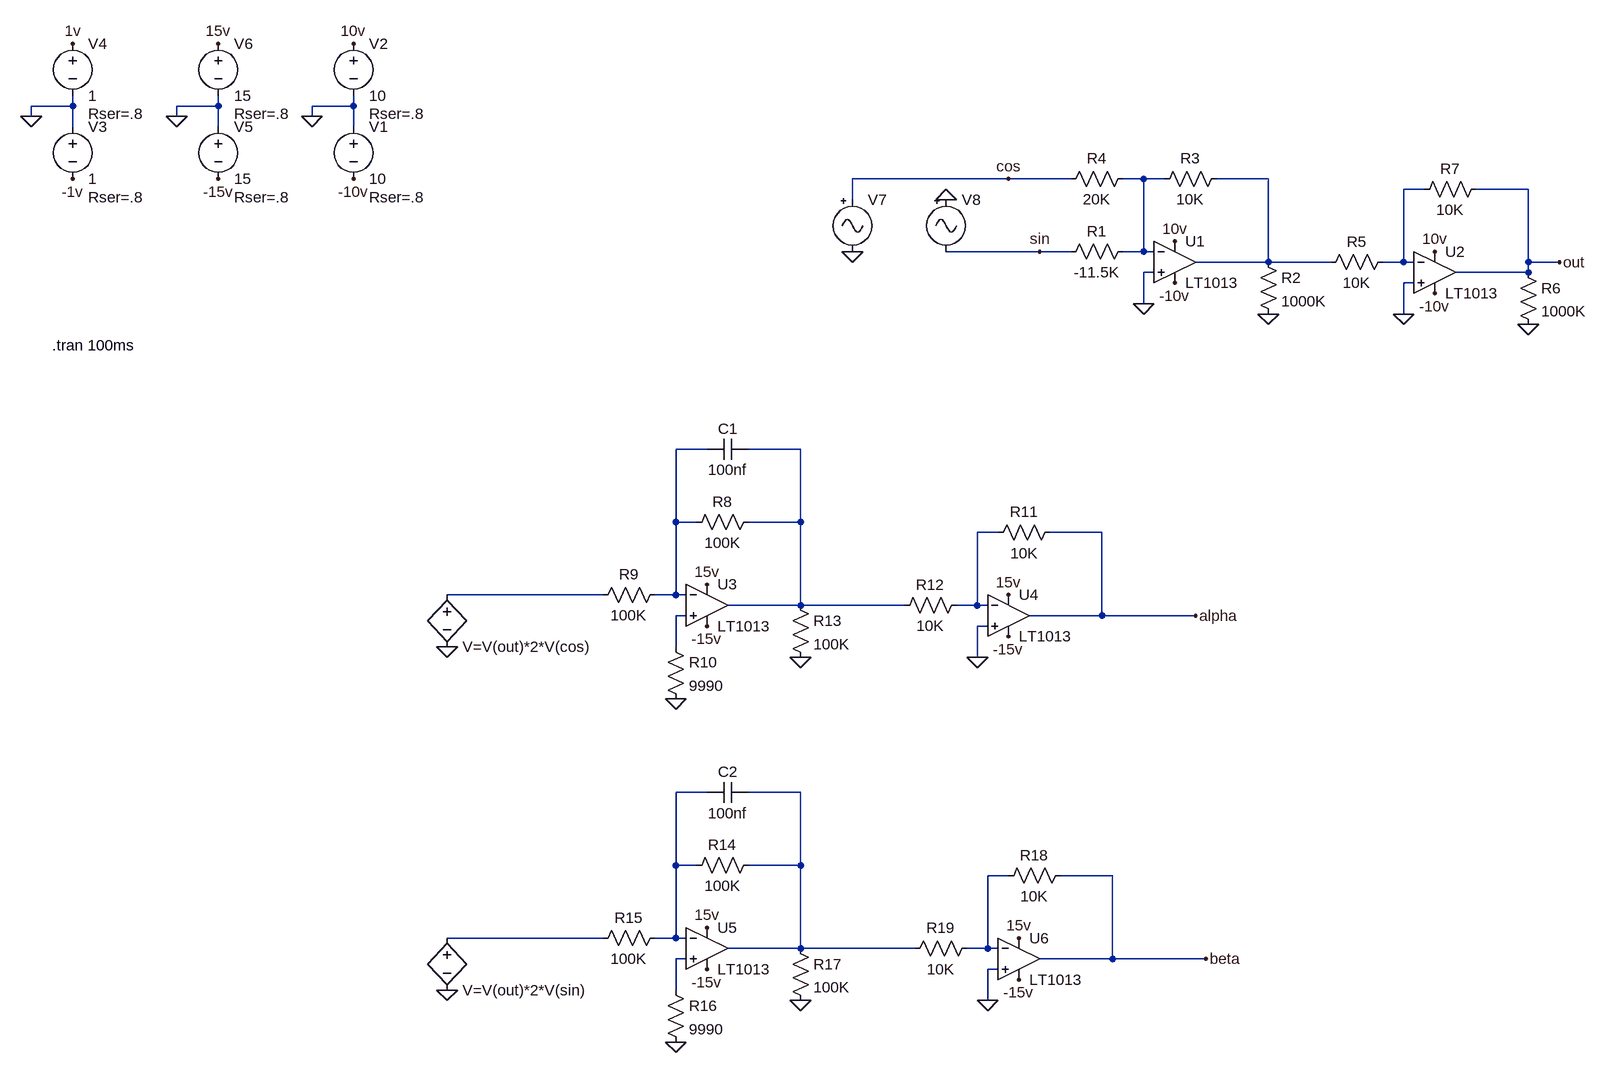
[diagram p0: schematic oscillating_qubit.asc]
oscillating_qubit.asc, the LTspice schematic file:
Version 4
SHEET 1 3584 1604
WIRE -736 144 -736 128
WIRE -736 144 -800 144
WIRE -512 144 -512 128
WIRE -512 144 -576 144
WIRE -304 144 -304 128
WIRE -304 144 -368 144
WIRE -800 160 -800 144
WIRE -576 160 -576 144
WIRE -368 160 -368 144
WIRE -736 176 -736 144
WIRE -512 176 -512 144
WIRE -304 176 -304 144
WIRE 704 256 464 256
WIRE 800 256 704 256
WIRE 912 256 880 256
WIRE 944 256 912 256
WIRE 1104 256 1024 256
WIRE 1344 272 1312 272
WIRE 1504 272 1424 272
WIRE 464 288 464 256
WIRE 752 368 608 368
WIRE 800 368 752 368
WIRE 912 368 912 256
WIRE 912 368 880 368
WIRE 928 368 912 368
WIRE 1104 384 1104 256
WIRE 1104 384 992 384
WIRE 1200 384 1104 384
WIRE 1312 384 1312 272
WIRE 1312 384 1280 384
WIRE 1328 384 1312 384
WIRE 1504 384 1504 272
WIRE 1552 384 1504 384
WIRE 928 400 912 400
WIRE 1504 400 1504 384
WIRE 1504 400 1392 400
WIRE 1328 416 1312 416
WIRE 912 448 912 400
WIRE 1312 464 1312 416
WIRE 240 672 192 672
WIRE 384 672 304 672
WIRE 192 784 192 672
WIRE 224 784 192 784
WIRE 384 784 384 672
WIRE 384 784 304 784
WIRE 688 800 656 800
WIRE 848 800 768 800
WIRE 80 896 -160 896
WIRE 192 896 192 784
WIRE 192 896 160 896
WIRE 208 896 192 896
WIRE 384 912 384 784
WIRE 384 912 272 912
WIRE 544 912 384 912
WIRE 656 912 656 800
WIRE 656 912 624 912
WIRE 672 912 656 912
WIRE 208 928 192 928
WIRE 848 928 848 800
WIRE 848 928 736 928
WIRE 992 928 848 928
WIRE 672 944 656 944
WIRE 192 976 192 928
WIRE 656 992 656 944
WIRE 240 1200 192 1200
WIRE 384 1200 304 1200
WIRE 192 1312 192 1200
WIRE 224 1312 192 1312
WIRE 384 1312 384 1200
WIRE 384 1312 304 1312
WIRE 704 1328 672 1328
WIRE 864 1328 784 1328
WIRE 80 1424 -160 1424
WIRE 192 1424 192 1312
WIRE 192 1424 160 1424
WIRE 208 1424 192 1424
WIRE 384 1440 384 1312
WIRE 384 1440 272 1440
WIRE 560 1440 384 1440
WIRE 672 1440 672 1328
WIRE 672 1440 640 1440
WIRE 688 1440 672 1440
WIRE 208 1456 192 1456
WIRE 864 1456 864 1328
WIRE 864 1456 752 1456
WIRE 1008 1456 864 1456
WIRE 688 1472 672 1472
WIRE 192 1504 192 1456
WIRE 672 1520 672 1472
FLAG -304 48 10v
FLAG -368 160 0
FLAG -304 256 -10v
FLAG -736 48 1v
FLAG -800 160 0
FLAG -736 256 -1v
FLAG 912 448 0
FLAG 960 352 10v
FLAG 960 416 -10v
FLAG 1104 464 0
FLAG 1552 384 out
FLAG 1312 464 0
FLAG 1360 368 10v
FLAG 1360 432 -10v
FLAG 1504 480 0
FLAG 240 880 15v
FLAG 240 944 -15v
FLAG 192 1056 0
FLAG 704 960 -15v
FLAG 656 992 0
FLAG 384 992 0
FLAG -512 48 15v
FLAG -576 160 0
FLAG -512 256 -15v
FLAG 704 896 15v
FLAG 992 928 alpha
FLAG -160 976 0
FLAG 240 1408 15v
FLAG 240 1472 -15v
FLAG 192 1584 0
FLAG 384 1520 0
FLAG -160 1504 0
FLAG 720 1488 -15v
FLAG 672 1520 0
FLAG 720 1424 15v
FLAG 1008 1456 beta
FLAG 464 368 0
FLAG 608 288 0
FLAG 704 256 cos
FLAG 752 368 sin
SYMBOL voltage -304 160 R0
WINDOW 123 0 0 Left 0
WINDOW 39 24 124 Left 2
SYMATTR SpiceLine Rser=.8
SYMATTR InstName V1
SYMATTR Value 10
SYMBOL voltage -304 32 R0
WINDOW 123 0 0 Left 0
WINDOW 39 24 124 Left 2
SYMATTR SpiceLine Rser=.8
SYMATTR InstName V2
SYMATTR Value 10
SYMBOL voltage -736 160 R0
WINDOW 123 0 0 Left 0
WINDOW 39 24 124 Left 2
SYMATTR SpiceLine Rser=.8
SYMATTR InstName V3
SYMATTR Value 1
SYMBOL voltage -736 32 R0
WINDOW 123 0 0 Left 0
WINDOW 39 24 124 Left 2
SYMATTR SpiceLine Rser=.8
SYMATTR InstName V4
SYMATTR Value 1
SYMBOL res 896 352 R90
WINDOW 0 0 56 VBottom 2
WINDOW 3 32 56 VTop 2
SYMATTR InstName R1
SYMATTR Value -11.5K
SYMBOL OpAmps\\LT1013 960 320 R0
SYMATTR InstName U1
SYMBOL res 1088 368 R0
SYMATTR InstName R2
SYMATTR Value 1000K
SYMBOL res 1040 240 R90
WINDOW 0 0 56 VBottom 2
WINDOW 3 32 56 VTop 2
SYMATTR InstName R3
SYMATTR Value 10K
SYMBOL res 896 240 R90
WINDOW 0 0 56 VBottom 2
WINDOW 3 32 56 VTop 2
SYMATTR InstName R4
SYMATTR Value 20K
SYMBOL res 1296 368 R90
WINDOW 0 0 56 VBottom 2
WINDOW 3 32 56 VTop 2
SYMATTR InstName R5
SYMATTR Value 10K
SYMBOL OpAmps\\LT1013 1360 336 R0
SYMATTR InstName U2
SYMBOL res 1488 384 R0
SYMATTR InstName R6
SYMATTR Value 1000K
SYMBOL res 1440 256 R90
WINDOW 0 0 56 VBottom 2
WINDOW 3 32 56 VTop 2
SYMATTR InstName R7
SYMATTR Value 10K
SYMBOL res 320 768 R90
WINDOW 0 0 56 VBottom 2
WINDOW 3 32 56 VTop 2
SYMATTR InstName R8
SYMATTR Value 100K
SYMBOL res 176 880 R90
WINDOW 0 0 56 VBottom 2
WINDOW 3 32 56 VTop 2
SYMATTR InstName R9
SYMATTR Value 100K
SYMBOL res 176 960 R0
SYMATTR InstName R10
SYMATTR Value 9990
SYMBOL res 784 784 R90
WINDOW 0 0 56 VBottom 2
WINDOW 3 32 56 VTop 2
SYMATTR InstName R11
SYMATTR Value 10K
SYMBOL res 640 896 R90
WINDOW 0 0 56 VBottom 2
WINDOW 3 32 56 VTop 2
SYMATTR InstName R12
SYMATTR Value 10K
SYMBOL res 368 896 R0
SYMATTR InstName R13
SYMATTR Value 100K
SYMBOL voltage -512 160 R0
WINDOW 123 0 0 Left 0
WINDOW 39 24 124 Left 2
SYMATTR SpiceLine Rser=.8
SYMATTR InstName V5
SYMATTR Value 15
SYMBOL voltage -512 32 R0
WINDOW 123 0 0 Left 0
WINDOW 39 24 124 Left 2
SYMATTR SpiceLine Rser=.8
SYMATTR InstName V6
SYMATTR Value 15
SYMBOL cap 304 656 R90
WINDOW 0 0 32 VBottom 2
WINDOW 3 32 32 VTop 2
SYMATTR InstName C1
SYMATTR Value 100nf
SYMBOL OpAmps\\LT1013 240 848 R0
SYMATTR InstName U3
SYMBOL OpAmps\\LT1013 704 864 R0
SYMATTR InstName U4
SYMBOL bv -160 880 R0
WINDOW 0 24 16 Invisible 2
SYMATTR InstName B1
SYMATTR Value V=V(out)*2*V(cos)
SYMBOL res 320 1296 R90
WINDOW 0 0 56 VBottom 2
WINDOW 3 32 56 VTop 2
SYMATTR InstName R14
SYMATTR Value 100K
SYMBOL res 176 1408 R90
WINDOW 0 0 56 VBottom 2
WINDOW 3 32 56 VTop 2
SYMATTR InstName R15
SYMATTR Value 100K
SYMBOL res 176 1488 R0
SYMATTR InstName R16
SYMATTR Value 9990
SYMBOL res 368 1424 R0
SYMATTR InstName R17
SYMATTR Value 100K
SYMBOL cap 304 1184 R90
WINDOW 0 0 32 VBottom 2
WINDOW 3 32 32 VTop 2
SYMATTR InstName C2
SYMATTR Value 100nf
SYMBOL OpAmps\\LT1013 240 1376 R0
SYMATTR InstName U5
SYMBOL bv -160 1408 R0
WINDOW 0 24 16 Invisible 2
SYMATTR InstName B2
SYMATTR Value V=V(out)*2*V(sin)
SYMBOL res 800 1312 R90
WINDOW 0 0 56 VBottom 2
WINDOW 3 32 56 VTop 2
SYMATTR InstName R18
SYMATTR Value 10K
SYMBOL res 656 1424 R90
WINDOW 0 0 56 VBottom 2
WINDOW 3 32 56 VTop 2
SYMATTR InstName R19
SYMATTR Value 10K
SYMBOL OpAmps\\LT1013 720 1392 R0
SYMATTR InstName U6
SYMBOL Misc\\signal 464 272 R0
WINDOW 3 24 104 Invisible 2
WINDOW 123 0 0 Left 0
WINDOW 39 0 0 Left 0
SYMATTR Value SINE(0 1 2K 0)
SYMATTR InstName V7
SYMBOL Misc\\signal 608 272 R0
WINDOW 3 24 104 Invisible 2
WINDOW 123 0 0 Left 0
WINDOW 39 0 0 Left 0
SYMATTR Value SINE(0 1 2K .000125)
SYMATTR InstName V8
TEXT -768 512 Left 2 !.tran 100ms

The netlist it stands for:
* oscillating_qubit.asc
V1 0 -10v 10 Rser=.8
V2 10v 0 10 Rser=.8
V3 0 -1v 1 Rser=.8
V4 1v 0 1 Rser=.8
R1 N001 sin -11.5K
XU1 0 N001 10v -10v N002 LT1013  ; pins In+ In- V+ V- OUT
R2 N002 0 1000K
R3 N002 N001 10K
R4 N001 cos 20K
R5 N003 N002 10K
XU2 0 N003 10v -10v out LT1013  ; pins In+ In- V+ V- OUT
R6 out 0 1000K
R7 out N003 10K
R8 N005 N004 100K
R9 N004 N007 100K
R10 N008 0 9990
R11 alpha N006 10K
R12 N006 N005 10K
R13 N005 0 100K
V5 0 -15v 15 Rser=.8
V6 15v 0 15 Rser=.8
C1 N005 N004 100nf
XU3 N008 N004 15v -15v N005 LT1013  ; pins In+ In- V+ V- OUT
XU4 0 N006 15v -15v alpha LT1013  ; pins In+ In- V+ V- OUT
B1 N007 0 V=V(out)*2*V(cos)
R14 N010 N009 100K
R15 N009 N012 100K
R16 N013 0 9990
R17 N010 0 100K
C2 N010 N009 100nf
XU5 N013 N009 15v -15v N010 LT1013  ; pins In+ In- V+ V- OUT
B2 N012 0 V=V(out)*2*V(sin)
R18 beta N011 10K
R19 N011 N010 10K
XU6 0 N011 15v -15v beta LT1013  ; pins In+ In- V+ V- OUT
V7 cos 0 SINE(0 1 2K 0)
V8 0 sin SINE(0 1 2K .000125)
.tran 100ms
.lib LTC.lib
.backanno
.end